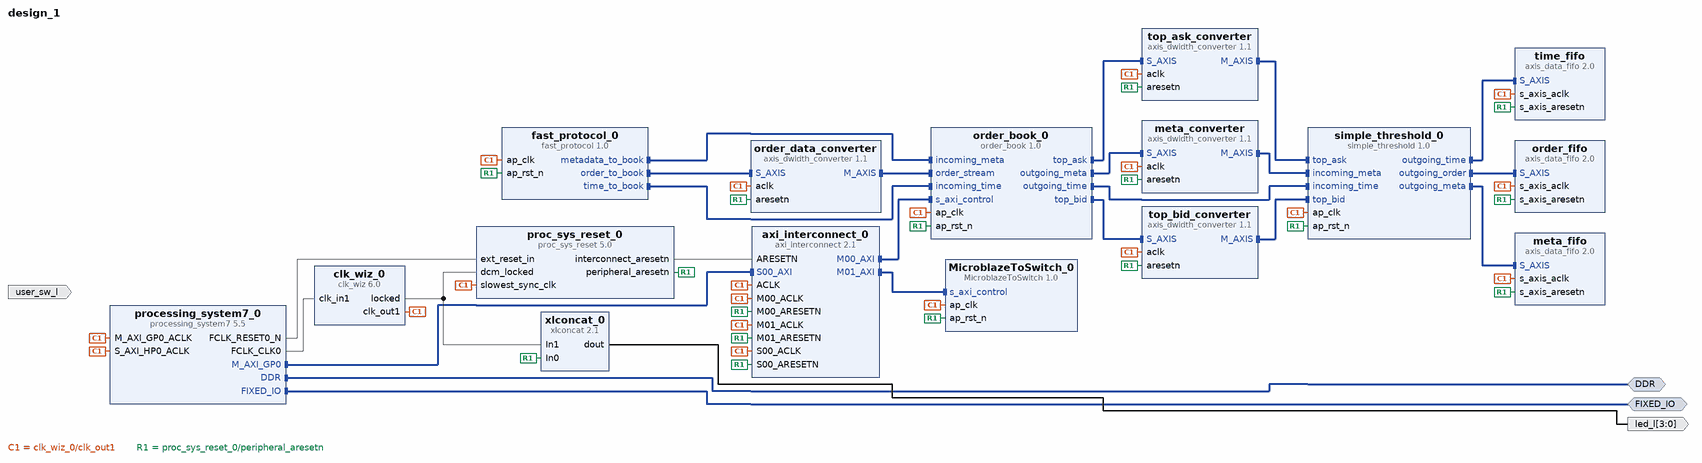
[diagram p0: block diagram of the top level]
# Vivado block design design_1, xc7z020clg400-1, Vivado 2024.2
create_bd_design design_1

create_bd_intf_port -mode Master -vlnv xilinx.com:interface:ddrx_rtl:1.0 DDR
create_bd_intf_port -mode Master -vlnv xilinx.com:display_processing_system7:fixedio_rtl:1.0 FIXED_IO
create_bd_port -dir O -from 3 -to 0 led_l
create_bd_port -dir I user_sw_l

create_bd_cell -type ip -vlnv xilinx.com:ip:processing_system7:5.5 processing_system7_0
set_property -dict [list \
  CONFIG.PCW_ENET0_ENET0_IO {MIO 16 .. 27} \
  CONFIG.PCW_ENET0_GRP_MDIO_ENABLE 1 \
  CONFIG.PCW_ENET0_GRP_MDIO_IO {MIO 52 .. 53} \
  CONFIG.PCW_ENET0_PERIPHERAL_ENABLE 1 \
  CONFIG.PCW_FPGA0_PERIPHERAL_FREQMHZ 100 \
  CONFIG.PCW_USE_S_AXI_HP0 1 \
] [get_bd_cells processing_system7_0]
# 76 more settings of processing_system7_0 are not shown: defaults, MIO pin electricals, DDR timing, and values the tool derives
create_bd_cell -type ip -vlnv xilinx.com:ip:clk_wiz:6.0 clk_wiz_0
set_property -dict [list \
  CONFIG.CLKOUT1_REQUESTED_OUT_FREQ 100.000 \
  CONFIG.PRIM_IN_FREQ 100.000 \
  CONFIG.USE_LOCKED true \
  CONFIG.USE_RESET false \
] [get_bd_cells clk_wiz_0]
create_bd_cell -type ip -vlnv xilinx.com:ip:axi_interconnect:2.1 axi_interconnect_0
set_property -dict {CONFIG.NUM_MI 2 CONFIG.NUM_SI 1} [get_bd_cells axi_interconnect_0]
create_bd_cell -type ip -vlnv xilinx.com:ip:proc_sys_reset:5.0 proc_sys_reset_0
create_bd_cell -type ip -vlnv xilinx.com:hls:fast_protocol:1.0 fast_protocol_0
create_bd_cell -type ip -vlnv xilinx.com:hls:order_book:1.0 order_book_0
create_bd_cell -type ip -vlnv xilinx.com:hls:simple_threshold:1.0 simple_threshold_0
create_bd_cell -type ip -vlnv xilinx.com:hls:MicroblazeToSwitch:1.0 MicroblazeToSwitch_0
create_bd_cell -type ip -vlnv xilinx.com:ip:axis_dwidth_converter:1.1 order_data_converter
set_property -dict {CONFIG.M_TDATA_NUM_BYTES 12 CONFIG.S_TDATA_NUM_BYTES 8} [get_bd_cells order_data_converter]
create_bd_cell -type ip -vlnv xilinx.com:ip:axis_dwidth_converter:1.1 top_ask_converter
set_property -dict {CONFIG.M_TDATA_NUM_BYTES 8 CONFIG.S_TDATA_NUM_BYTES 12} [get_bd_cells top_ask_converter]
create_bd_cell -type ip -vlnv xilinx.com:ip:axis_dwidth_converter:1.1 top_bid_converter
set_property -dict {CONFIG.M_TDATA_NUM_BYTES 8 CONFIG.S_TDATA_NUM_BYTES 12} [get_bd_cells top_bid_converter]
create_bd_cell -type ip -vlnv xilinx.com:ip:axis_dwidth_converter:1.1 meta_converter
set_property -dict {CONFIG.M_TDATA_NUM_BYTES 12 CONFIG.S_TDATA_NUM_BYTES 16} [get_bd_cells meta_converter]
create_bd_cell -type ip -vlnv xilinx.com:ip:axis_data_fifo:2.0 order_fifo
create_bd_cell -type ip -vlnv xilinx.com:ip:axis_data_fifo:2.0 meta_fifo
create_bd_cell -type ip -vlnv xilinx.com:ip:axis_data_fifo:2.0 time_fifo
create_bd_cell -type ip -vlnv xilinx.com:ip:xlconcat:2.1 xlconcat_0
set_property -dict {CONFIG.NUM_PORTS 4} [get_bd_cells xlconcat_0]

# ---- connections ----

connect_bd_intf_net [get_bd_intf_pins axi_interconnect_0/M00_AXI] [get_bd_intf_pins order_book_0/s_axi_control]
connect_bd_intf_net [get_bd_intf_pins axi_interconnect_0/M01_AXI] [get_bd_intf_pins MicroblazeToSwitch_0/s_axi_control]
connect_bd_intf_net [get_bd_intf_pins fast_protocol_0/metadata_to_book] [get_bd_intf_pins order_book_0/incoming_meta]
connect_bd_intf_net [get_bd_intf_pins fast_protocol_0/order_to_book] [get_bd_intf_pins order_data_converter/S_AXIS]
connect_bd_intf_net [get_bd_intf_pins fast_protocol_0/time_to_book] [get_bd_intf_pins order_book_0/incoming_time]
connect_bd_intf_net [get_bd_intf_pins meta_converter/M_AXIS] [get_bd_intf_pins simple_threshold_0/incoming_meta]
connect_bd_intf_net [get_bd_intf_pins order_book_0/outgoing_meta] [get_bd_intf_pins meta_converter/S_AXIS]
connect_bd_intf_net [get_bd_intf_pins order_book_0/outgoing_time] [get_bd_intf_pins simple_threshold_0/incoming_time]
connect_bd_intf_net [get_bd_intf_pins order_book_0/top_ask] [get_bd_intf_pins top_ask_converter/S_AXIS]
connect_bd_intf_net [get_bd_intf_pins order_book_0/top_bid] [get_bd_intf_pins top_bid_converter/S_AXIS]
connect_bd_intf_net [get_bd_intf_pins order_data_converter/M_AXIS] [get_bd_intf_pins order_book_0/order_stream]
connect_bd_intf_net [get_bd_intf_ports DDR] [get_bd_intf_pins processing_system7_0/DDR]
connect_bd_intf_net [get_bd_intf_ports FIXED_IO] [get_bd_intf_pins processing_system7_0/FIXED_IO]
connect_bd_intf_net [get_bd_intf_pins processing_system7_0/M_AXI_GP0] [get_bd_intf_pins axi_interconnect_0/S00_AXI]
connect_bd_intf_net [get_bd_intf_pins simple_threshold_0/outgoing_meta] [get_bd_intf_pins meta_fifo/S_AXIS]
connect_bd_intf_net [get_bd_intf_pins simple_threshold_0/outgoing_order] [get_bd_intf_pins order_fifo/S_AXIS]
connect_bd_intf_net [get_bd_intf_pins simple_threshold_0/outgoing_time] [get_bd_intf_pins time_fifo/S_AXIS]
connect_bd_intf_net [get_bd_intf_pins top_ask_converter/M_AXIS] [get_bd_intf_pins simple_threshold_0/top_ask]
connect_bd_intf_net [get_bd_intf_pins top_bid_converter/M_AXIS] [get_bd_intf_pins simple_threshold_0/top_bid]
connect_bd_net [get_bd_pins clk_wiz_0/clk_out1] \
  [get_bd_pins axi_interconnect_0/ACLK] [get_bd_pins axi_interconnect_0/S00_ACLK] \
  [get_bd_pins processing_system7_0/M_AXI_GP0_ACLK] [get_bd_pins proc_sys_reset_0/slowest_sync_clk] \
  [get_bd_pins fast_protocol_0/ap_clk] [get_bd_pins order_book_0/ap_clk] [get_bd_pins simple_threshold_0/ap_clk] \
  [get_bd_pins MicroblazeToSwitch_0/ap_clk] [get_bd_pins order_data_converter/aclk] [get_bd_pins top_ask_converter/aclk] \
  [get_bd_pins top_bid_converter/aclk] [get_bd_pins meta_converter/aclk] [get_bd_pins order_fifo/s_axis_aclk] \
  [get_bd_pins meta_fifo/s_axis_aclk] [get_bd_pins time_fifo/s_axis_aclk] [get_bd_pins axi_interconnect_0/M00_ACLK] \
  [get_bd_pins axi_interconnect_0/M01_ACLK] [get_bd_pins processing_system7_0/S_AXI_HP0_ACLK]
connect_bd_net [get_bd_pins clk_wiz_0/locked] [get_bd_pins proc_sys_reset_0/dcm_locked] [get_bd_pins xlconcat_0/In1]
connect_bd_net [get_bd_pins proc_sys_reset_0/interconnect_aresetn] [get_bd_pins axi_interconnect_0/ARESETN]
connect_bd_net [get_bd_pins proc_sys_reset_0/peripheral_aresetn] \
  [get_bd_pins fast_protocol_0/ap_rst_n] [get_bd_pins order_book_0/ap_rst_n] [get_bd_pins simple_threshold_0/ap_rst_n] \
  [get_bd_pins MicroblazeToSwitch_0/ap_rst_n] [get_bd_pins order_data_converter/aresetn] \
  [get_bd_pins top_ask_converter/aresetn] [get_bd_pins top_bid_converter/aresetn] [get_bd_pins meta_converter/aresetn] \
  [get_bd_pins order_fifo/s_axis_aresetn] [get_bd_pins meta_fifo/s_axis_aresetn] [get_bd_pins time_fifo/s_axis_aresetn] \
  [get_bd_pins axi_interconnect_0/M00_ARESETN] [get_bd_pins axi_interconnect_0/M01_ARESETN] \
  [get_bd_pins axi_interconnect_0/S00_ARESETN] [get_bd_pins xlconcat_0/In0]
connect_bd_net [get_bd_pins processing_system7_0/FCLK_CLK0] [get_bd_pins clk_wiz_0/clk_in1]
connect_bd_net [get_bd_pins processing_system7_0/FCLK_RESET0_N] [get_bd_pins proc_sys_reset_0/ext_reset_in]
connect_bd_net [get_bd_pins xlconcat_0/dout] [get_bd_ports led_l]

# ---- address map ----
assign_bd_address -offset 0x40000000 -range 64K -target_address_space [get_bd_addr_spaces processing_system7_0/Data] [get_bd_addr_segs MicroblazeToSwitch_0/s_axi_control/Reg]
assign_bd_address -offset 0x40010000 -range 64K -target_address_space [get_bd_addr_spaces processing_system7_0/Data] [get_bd_addr_segs order_book_0/s_axi_control/Reg]

validate_bd_design
save_bd_design
